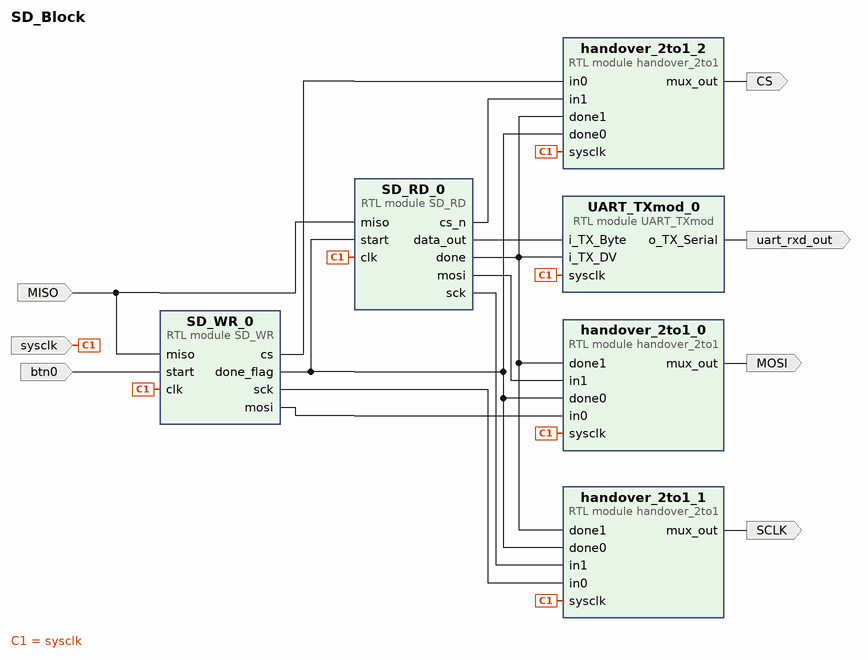
[diagram p0: block diagram of the top level]
# Vivado block design SD_Block, xc7a35tcpg236-1, Vivado 2024.2
create_bd_design SD_Block

create_bd_port -dir I btn0
create_bd_port -dir I sysclk
create_bd_port -dir I MISO
create_bd_port -dir O MOSI
create_bd_port -dir O CS
create_bd_port -dir O SCLK
create_bd_port -dir O uart_rxd_out

create_bd_cell -type module -reference SD_RD SD_RD_0
create_bd_cell -type module -reference SD_WR SD_WR_0
create_bd_cell -type module -reference UART_TXmod UART_TXmod_0
create_bd_cell -type module -reference handover_2to1 handover_2to1_0
create_bd_cell -type module -reference handover_2to1 handover_2to1_1
create_bd_cell -type module -reference handover_2to1 handover_2to1_2

# ---- connections ----

connect_bd_net [get_bd_ports MISO] [get_bd_pins SD_WR_0/miso] [get_bd_pins SD_RD_0/miso]
connect_bd_net [get_bd_pins SD_RD_0/cs_n] [get_bd_pins handover_2to1_2/in1]
connect_bd_net [get_bd_pins SD_RD_0/data_out] [get_bd_pins UART_TXmod_0/i_TX_Byte]
connect_bd_net [get_bd_pins SD_RD_0/done] \
  [get_bd_pins UART_TXmod_0/i_TX_DV] [get_bd_pins handover_2to1_0/done1] [get_bd_pins handover_2to1_1/done1] \
  [get_bd_pins handover_2to1_2/done1]
connect_bd_net [get_bd_pins SD_RD_0/mosi] [get_bd_pins handover_2to1_0/in1]
connect_bd_net [get_bd_pins SD_RD_0/sck] [get_bd_pins handover_2to1_1/in1]
connect_bd_net [get_bd_pins SD_WR_0/cs] [get_bd_pins handover_2to1_2/in0]
connect_bd_net [get_bd_pins SD_WR_0/done_flag] \
  [get_bd_pins SD_RD_0/start] [get_bd_pins handover_2to1_0/done0] [get_bd_pins handover_2to1_1/done0] \
  [get_bd_pins handover_2to1_2/done0]
connect_bd_net [get_bd_pins SD_WR_0/mosi] [get_bd_pins handover_2to1_0/in0]
connect_bd_net [get_bd_pins SD_WR_0/sck] [get_bd_pins handover_2to1_1/in0]
connect_bd_net [get_bd_pins UART_TXmod_0/o_TX_Serial] [get_bd_ports uart_rxd_out]
connect_bd_net -net btn0_1 [get_bd_ports btn0] [get_bd_pins SD_WR_0/start]
connect_bd_net [get_bd_pins handover_2to1_0/mux_out] [get_bd_ports MOSI]
connect_bd_net [get_bd_pins handover_2to1_1/mux_out] [get_bd_ports SCLK]
connect_bd_net [get_bd_pins handover_2to1_2/mux_out] [get_bd_ports CS]
connect_bd_net [get_bd_ports sysclk] \
  [get_bd_pins SD_RD_0/clk] [get_bd_pins SD_WR_0/clk] [get_bd_pins UART_TXmod_0/sysclk] [get_bd_pins handover_2to1_0/sysclk] \
  [get_bd_pins handover_2to1_1/sysclk] [get_bd_pins handover_2to1_2/sysclk]

validate_bd_design
save_bd_design
